# EAGLE design midiprog (EAGLE 6.5.0)
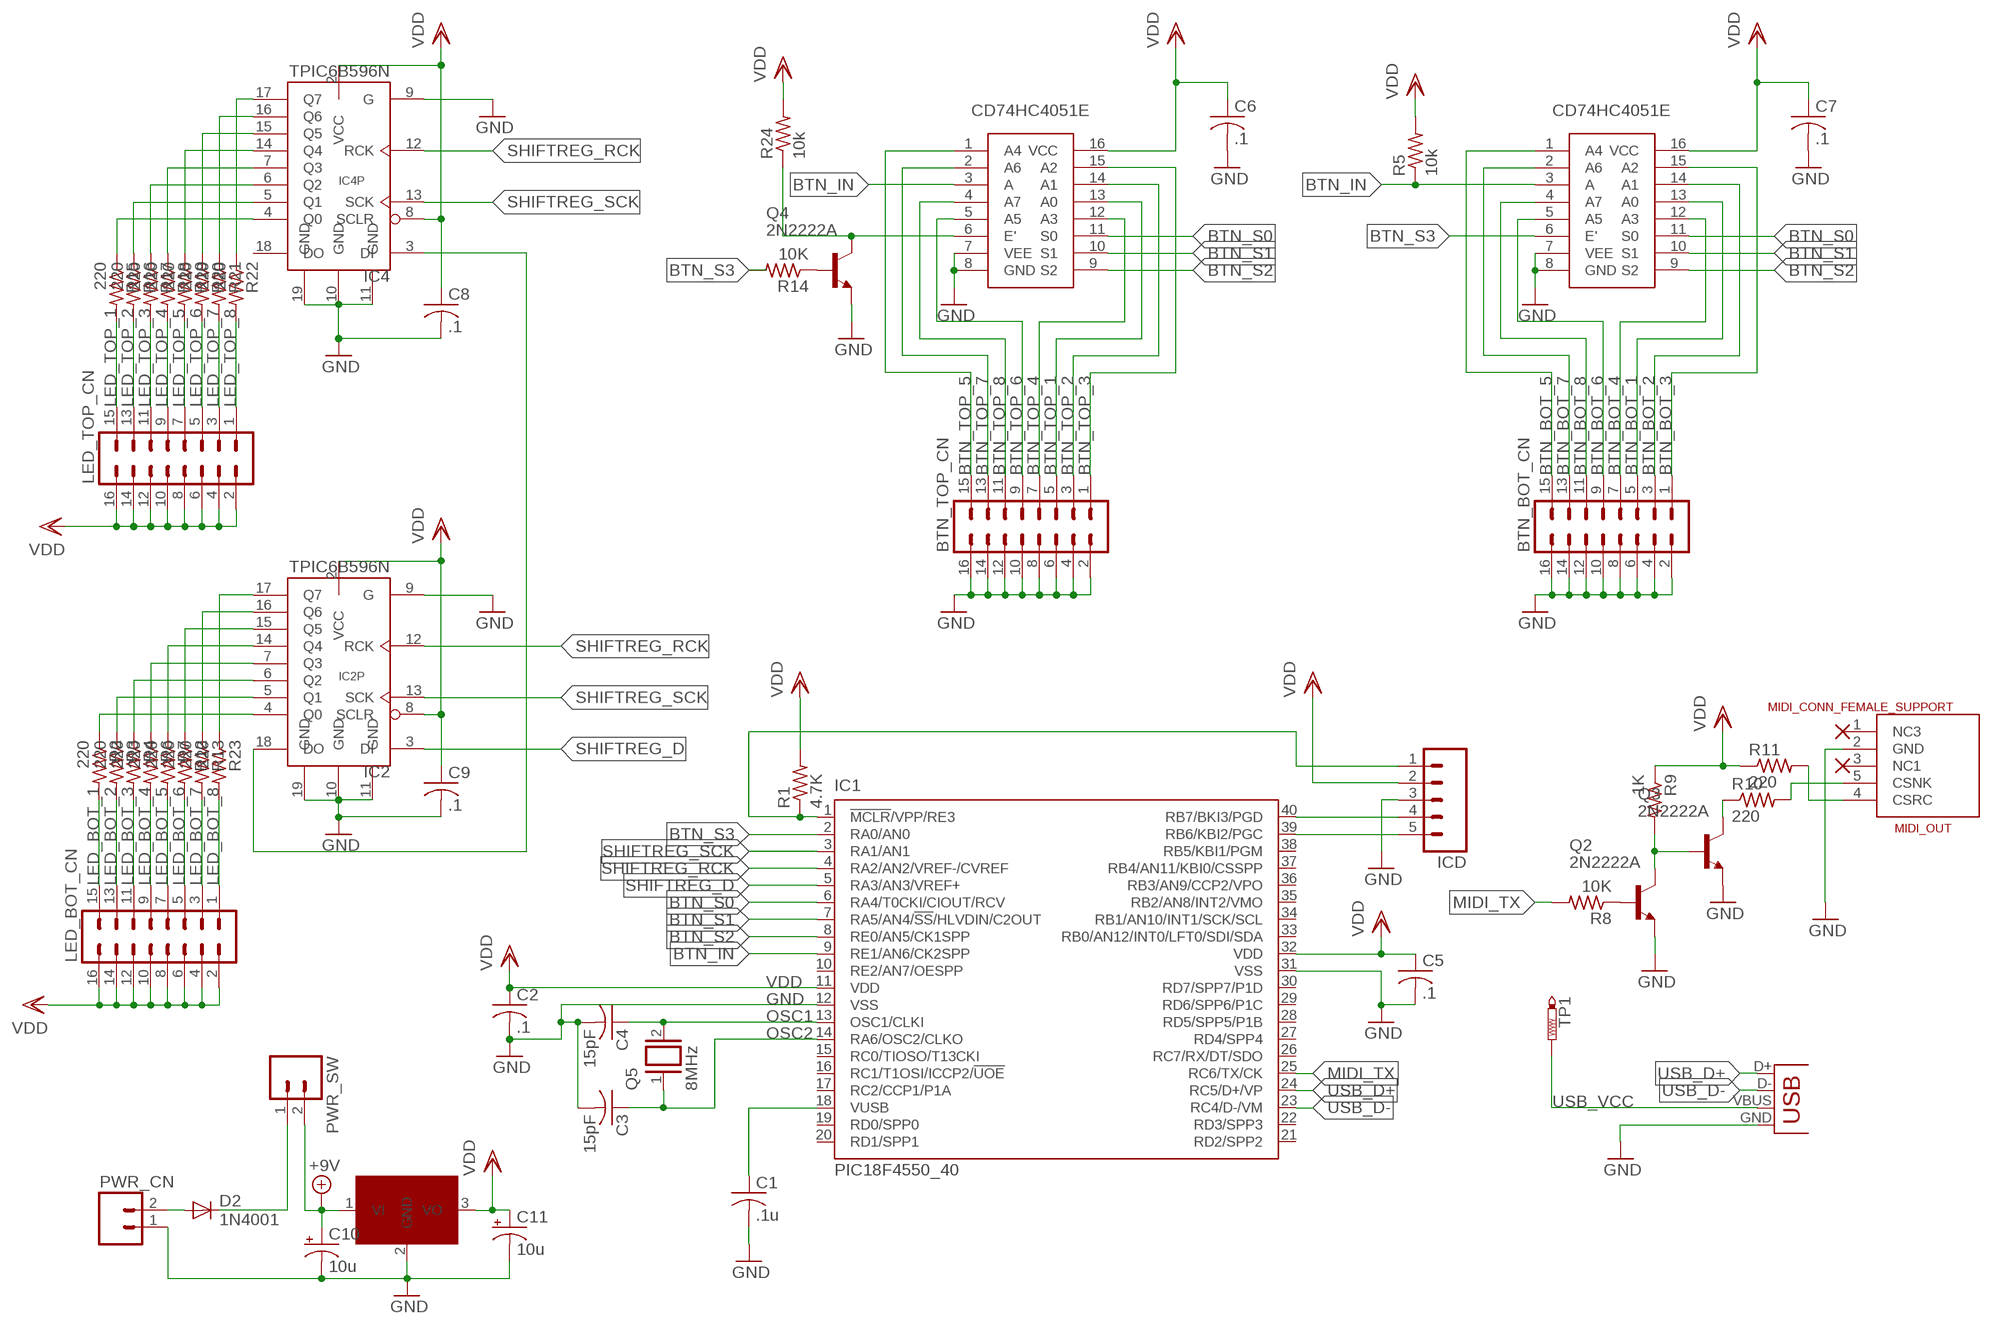
[diagram p0: schematic, sheet 1]

## Parts
BTN_BOT_CN  MA08-2  [MA08-2]
BTN_TOP_CN  MA08-2  [MA08-2]
C1  .1u  C-US050-025X075  [C050-025X075]
C2  .1  C-US050-025X075  [C050-025X075]
C3  15pF  C-US050-025X075  [C050-025X075]
C4  15pF  C-US050-025X075  [C050-025X075]
C5  .1  C-US050-025X075  [C050-025X075]
C6  .1  C-US050-025X075  [C050-025X075]
C7  .1  C-US050-025X075  [C050-025X075]
C8  .1  C-US050-025X075  [C050-025X075]
C9  .1  C-US050-025X075  [C050-025X075]
C10  10u  CPOL-USE2.5-6  [E2,5-6]
C11  10u  CPOL-USE2.5-6  [E2,5-6]
D2  1N4001  1N4004  [DO41-10]
IC1  PIC18F4550_40  [DIL40]
IC2  TPIC6B596N  [DIL20]
IC4  TPIC6B596N  [DIL20]
ICD  MA05  [05PA]
JP1  USB-B  USBPTH  [USB-B-PTH]
LED_BOT_CN  MA08-2  [MA08-2]
LED_TOP_CN  MA08-2  [MA08-2]
MIDI_OUT  MIDI_CONN_FEMALE_SUPPORT  [DIN_5_FEMALE_SUPPORT]
PWR_CN  M02  [02P]
PWR_SW  M02  [02P]
Q2  2N2222A  [TO18]
Q3  2N2222A  [TO18]
Q4  2N2222A  [TO18]
Q5  8MHz  XTAL/S  [QS]
R1  4.7K  R-US_0207/10  [0207/10]
R2  220  R-US_0207/10  [0207/10]
R3  220  R-US_0207/10  [0207/10]
R4  220  R-US_0207/10  [0207/10]
R5  10k  R-US_0207/10  [0207/10]
R6  220  R-US_0207/10  [0207/10]
R7  220  R-US_0207/10  [0207/10]
R8  10K  R-US_0207/10  [0207/10]
R9  1K  R-US_0207/10  [0207/10]
R10  220  R-US_0207/10  [0207/10]
R11  220  R-US_0207/10  [0207/10]
R12  220  R-US_0207/10  [0207/10]
R13  220  R-US_0207/10  [0207/10]
R14  10K  R-US_0207/10  [0207/10]
R15  220  R-US_0207/10  [0207/10]
R16  220  R-US_0207/10  [0207/10]
R17  220  R-US_0207/10  [0207/10]
R18  220  R-US_0207/10  [0207/10]
R19  220  R-US_0207/10  [0207/10]
R20  220  R-US_0207/10  [0207/10]
R21  220  R-US_0207/10  [0207/10]
R22  220  R-US_0207/10  [0207/10]
R23  220  R-US_0207/10  [0207/10]
R24  10k  R-US_0207/10  [0207/10]
TP1  PTR1PAD1-17  [P1-17]
U$1  CD74HC4051E  [CD74HC4051E]
U$2  CD74HC4051E  [CD74HC4051E]
U$3  7805  [JKDFJD]

## Nets
+9V: C10.+ PWR_SW.2 U$3.1(VI)
BTN_BOT_1: BTN_BOT_CN.5 U$1.13(A0)
BTN_BOT_2: BTN_BOT_CN.3 U$1.14(A1)
BTN_BOT_3: BTN_BOT_CN.1 U$1.15(A2)
BTN_BOT_4: BTN_BOT_CN.7 U$1.12(A3)
BTN_BOT_5: BTN_BOT_CN.15 U$1.1(A4)
BTN_BOT_6: BTN_BOT_CN.9 U$1.5(A5)
BTN_BOT_7: BTN_BOT_CN.13 U$1.2(A6)
BTN_BOT_8: BTN_BOT_CN.11 U$1.4(A7)
BTN_IN: IC1.9(RE1/AN6/CK2SPP) R5.1 U$1.3(A) U$2.3(A)
BTN_S0: IC1.6(RA4/T0CKI/CIOUT/RCV) U$1.11(S0) U$2.11(S0)
BTN_S1: IC1.7(RA5/AN4/!SS!/HLVDIN/C2OUT) U$1.10(S1) U$2.10(S1)
BTN_S2: IC1.8(RE0/AN5/CK1SPP) U$1.9(S2) U$2.9(S2)
BTN_S3: IC1.2(RA0/AN0) R14.2 U$1.6(E')
BTN_TOP_1: BTN_TOP_CN.5 U$2.13(A0)
BTN_TOP_2: BTN_TOP_CN.3 U$2.14(A1)
BTN_TOP_3: BTN_TOP_CN.1 U$2.15(A2)
BTN_TOP_4: BTN_TOP_CN.7 U$2.12(A3)
BTN_TOP_5: BTN_TOP_CN.15 U$2.1(A4)
BTN_TOP_6: BTN_TOP_CN.9 U$2.5(A5)
BTN_TOP_7: BTN_TOP_CN.13 U$2.2(A6)
BTN_TOP_8: BTN_TOP_CN.11 U$2.4(A7)
GND: BTN_BOT_CN.2 BTN_BOT_CN.4 BTN_BOT_CN.6 BTN_BOT_CN.8 BTN_BOT_CN.10 BTN_BOT_CN.12 BTN_BOT_CN.14 BTN_BOT_CN.16 BTN_TOP_CN.2 BTN_TOP_CN.4 BTN_TOP_CN.6 BTN_TOP_CN.8 BTN_TOP_CN.10 BTN_TOP_CN.12 BTN_TOP_CN.14 BTN_TOP_CN.16 C1.2 C2.2 C3.2 C4.2 C5.2 C6.2 C7.2 C8.2 C9.2 C10.- C11.- IC1.12(VSS) IC1.31(VSS) IC2.9(G) IC2.10(GND) IC2.11(GND) IC2.19(GND) IC4.9(G) IC4.10(GND) IC4.11(GND) IC4.19(GND) ICD.3 JP1.GND MIDI_OUT.2(GND) PWR_CN.1 Q2.1(E) Q3.1(E) Q4.1(E) U$1.7(VEE) U$1.8(GND) U$2.7(VEE) U$2.8(GND) U$3.2(GND)
LED_BOT_1: LED_BOT_CN.15 R2.2
LED_BOT_2: LED_BOT_CN.13 R3.2
LED_BOT_3: LED_BOT_CN.11 R4.2
LED_BOT_4: LED_BOT_CN.9 R6.2
LED_BOT_5: LED_BOT_CN.7 R7.2
LED_BOT_6: LED_BOT_CN.5 R12.2
LED_BOT_7: LED_BOT_CN.3 R13.2
LED_BOT_8: LED_BOT_CN.1 R23.2
LED_TOP_1: LED_TOP_CN.15 R15.2
LED_TOP_2: LED_TOP_CN.13 R16.2
LED_TOP_3: LED_TOP_CN.11 R17.2
LED_TOP_4: LED_TOP_CN.9 R18.2
LED_TOP_5: LED_TOP_CN.7 R19.2
LED_TOP_6: LED_TOP_CN.5 R20.2
LED_TOP_7: LED_TOP_CN.3 R21.2
LED_TOP_8: LED_TOP_CN.1 R22.2
MIDI_TX: IC1.25(RC6/TX/CK) R8.2
N$1: IC1.1(!MCLR!/VPP/RE3) ICD.1 R1.1
N$4: Q2.2(B) R8.1
N$5: Q2.3(C) Q3.2(B) R9.2
N$7: Q3.3(C) R10.1
N$8: MIDI_OUT.4(CSRC) R11.2
N$9: MIDI_OUT.5(CSNK) R10.2
N$16: IC1.39(RB6/KBI2/PGC) ICD.5
N$17: IC1.40(RB7/BKI3/PGD) ICD.4
N$18: C1.1 IC1.18(VUSB)
N$19: IC4.4(Q0) R15.1
N$20: IC4.5(Q1) R16.1
N$21: IC4.6(Q2) R17.1
N$22: IC4.7(Q3) R18.1
N$23: IC4.14(Q4) R19.1
N$25: IC4.15(Q5) R20.1
N$26: IC4.16(Q6) R21.1
N$29: IC4.17(Q7) R22.1
N$31: IC2.18(DO) IC4.3(DI)
N$34: D2.A PWR_CN.2
N$35: D2.C PWR_SW.1
N$38: IC2.4(Q0) R2.1
N$39: IC2.5(Q1) R3.1
N$40: IC2.6(Q2) R4.1
N$41: IC2.7(Q3) R6.1
N$42: IC2.14(Q4) R7.1
N$43: IC2.15(Q5) R12.1
N$44: IC2.16(Q6) R13.1
N$45: IC2.17(Q7) R23.1
N$53: Q4.2(B) R14.1
N$54: Q4.3(C) R24.1 U$2.6(E')
OSC1: C4.1 IC1.13(OSC1/CLKI) Q5.2
OSC2: C3.1 IC1.14(RA6/OSC2/CLKO) Q5.1
SHIFTREG_D: IC1.5(RA3/AN3/VREF+) IC2.3(DI)
SHIFTREG_RCK: IC1.4(RA2/AN2/VREF-/CVREF) IC2.12(RCK) IC4.12(RCK)
SHIFTREG_SCK: IC1.3(RA1/AN1) IC2.13(SCK) IC4.13(SCK)
USB_D+: IC1.24(RC5/D+/VP) JP1.D+
USB_D-: IC1.23(RC4/D-/VM) JP1.D-
USB_VCC: JP1.VBUS TP1.TP
VDD: C2.1 C5.1 C6.1 C7.1 C8.1 C9.1 C11.+ IC1.11(VDD) IC1.32(VDD) IC2.2(VCC) IC2.8(SCLR) IC4.2(VCC) IC4.8(SCLR) ICD.2 LED_BOT_CN.2 LED_BOT_CN.4 LED_BOT_CN.6 LED_BOT_CN.8 LED_BOT_CN.10 LED_BOT_CN.12 LED_BOT_CN.14 LED_BOT_CN.16 LED_TOP_CN.2 LED_TOP_CN.4 LED_TOP_CN.6 LED_TOP_CN.8 LED_TOP_CN.10 LED_TOP_CN.12 LED_TOP_CN.14 LED_TOP_CN.16 R1.2 R5.2 R9.1 R11.1 R24.2 U$1.16(VCC) U$2.16(VCC) U$3.3(VO)
Unconnected: IC1.10(RE2/AN7/OESPP) IC1.15(RC0/TIOSO/T13CKI) IC1.16(RC1/T1OSI/ICCP2/!UOE) IC1.17(RC2/CCP1/P1A) IC1.19(RD0/SPP0) IC1.20(RD1/SPP1) IC1.21(RD2/SPP2) IC1.22(RD3/SPP3) IC1.26(RC7/RX/DT/SDO) IC1.27(RD4/SPP4) IC1.28(RD5/SPP5/P1B) IC1.29(RD6/SPP6/P1C) IC1.30(RD7/SPP7/P1D) IC1.33(RB0/AN12/INT0/LFT0/SDI/SDA) IC1.34(RB1/AN10/INT1/SCK/SCL) IC1.35(RB2/AN8/INT2/VMO) IC1.36(RB3/AN9/CCP2/VPO) IC1.37(RB4/AN11/KBI0/CSSPP) IC1.38(RB5/KBI1/PGM) IC4.18(DO) MIDI_OUT.1(NC3) MIDI_OUT.3(NC1)

## Library data of the parts
BTN_BOT_CN BTN_TOP_CN LED_BOT_CN LED_TOP_CN = con-lstb:MA08-2: PIN HEADER; OC_FARNELL: unknown; OC_NEWARK: unknown
C1-C9 = rcl:C-US: CAPACITOR, American symbol
C10 C11 = rcl:CPOL-US: POLARIZED CAPACITOR, American symbol
D2 = diode:1N4004: DIODE general purpose rectifier, 1 A
IC1 = microchip:PIC18F4*_40: USB Microcontrollers with nanoWatt Technology High-Performance, Enhanced Flash, 28/40/44-Pin, Source: http://ww1.microchip.com/downloads/en/devicedoc/39632c.pdf; MF: MICROCHIP; MPN: PIC18F4550-I/P; OC_FARNELL: 9321357; OC_NEWARK: 74K8623
IC2 IC4 = tpic:TPIC6B596
ICD = con-amp-quick:MA05: AMP QUICK CONNECTOR; OC_FARNELL: unknown; OC_NEWARK: unknown
JP1 = SparkFun-Connectors:USB: USB Connectors USB-B-PTH is fully proven SKU : PRT-00139/CONN-08278 USB-miniB is fully proven SKU : PRT-00587 USB-A-PCB is untested. USB-A-H is throughly reviewed, but untested. Spark Fun Electronics SKU : PRT-00437 USB-B-SMT is throughly reviewed, but untested. Needs silkscreen touching up. USB-A-S has not been used/tested USB-MB-H has not been used/tested USB-MICROB has been used. CONN-09505; PROD_ID: CONN-08278
MIDI_OUT = SparkFun-Connectors:MIDI_CONN_FEMALE_SUPPORT: MIDI connector with strain relief (DIN-5 female)
PWR_CN PWR_SW = con-amp-quick:M02: AMP QUICK CONNECTOR; OC_FARNELL: unknown; OC_NEWARK: unknown
Q2-Q4 = transistor-npn:2N2222*: NPN Transistor
Q5 = special:XTAL/S: CRYSTAL
R1-R24 = rcl:R-US_: RESISTOR, American symbol
TP1 = testpad:PTR1: TEST PIN
U$1 U$2 = joe:CD74HC4051E
U$3 = 7805:7805

## Board
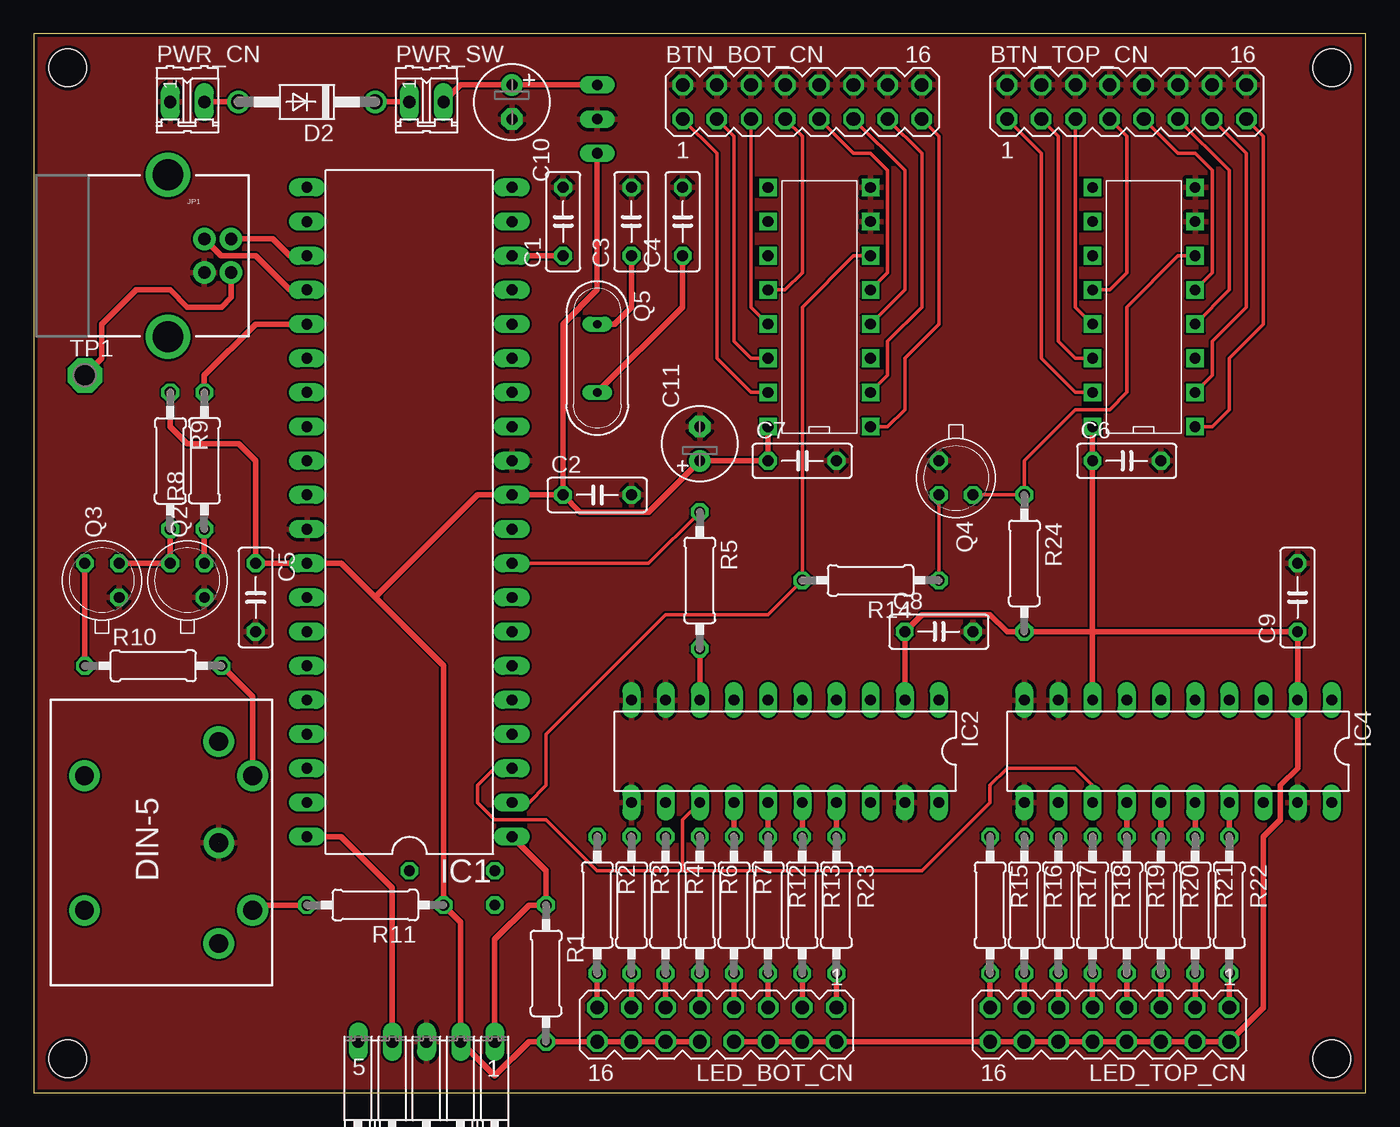
[diagram p1: board, top side]
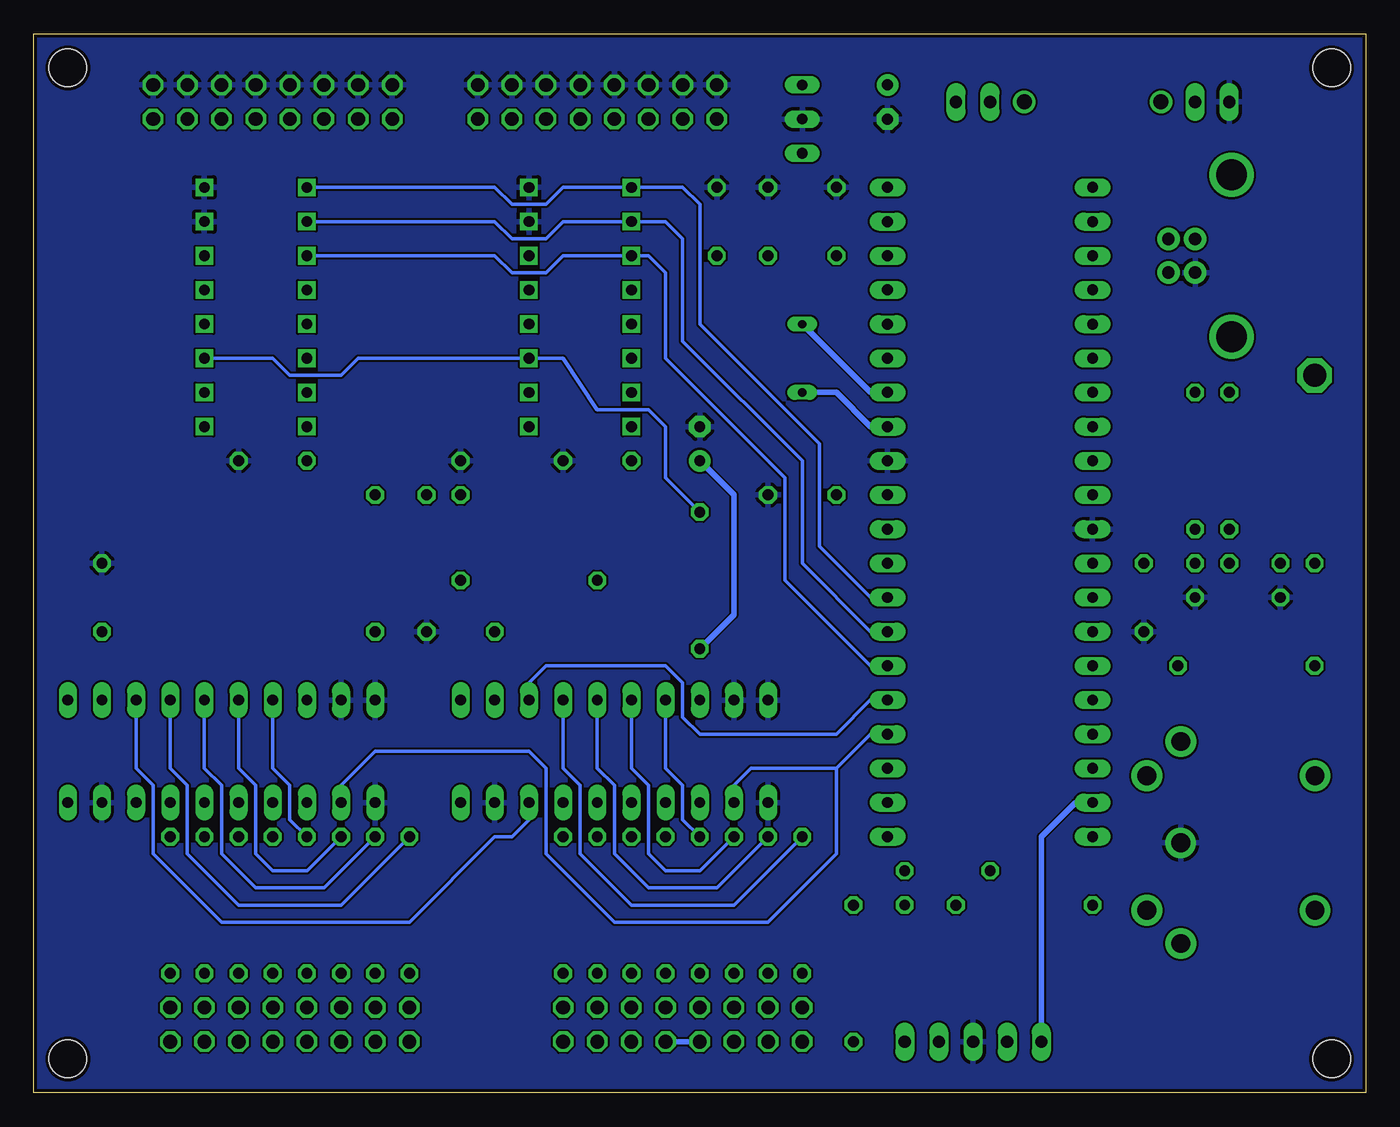
[diagram p2: board, bottom side, seen from below]

Size 99.06 x 78.74 mm. Coordinates in mm from the lower left corner, seen from the top.
Outline: 99.06,78.74 0,78.74 0,0 99.06,0 99.06,78.74
Copper layers (1*16): Top 0.035mm / dielectric 1.5mm / Bottom 0.035mm
Design rules "SeeedStudio_DRU-2layer_no_angle_20130527": minimum track width 6mil, minimum drill 12mil, track to track 6mil, track to pad 6mil, pad to pad 6mil, via to via 6mil, smd to smd 0mil, copper to edge 10mil, drill to drill 10mil, minimum pad ring 10mil, minimum via ring 6mil, stop-mask expansion 2mil, vias tented up to drill 25mil, thermal gap 10mil
Holes 2.8 mm at 96.52,2.54 96.52,76.2 2.54,76.2 2.54,2.54

### Footprints (pad centres in the part's own frame; a part is rotated, then mirrored left to right if it is on the bottom)
MA08-2 = drill 1.016 octagon: 1 -8.89,-1.27; 2 -8.89,1.27; 3 -6.35,-1.27; 4 -6.35,1.27; 5 -3.81,-1.27; 6 -3.81,1.27; 7 -1.27,-1.27; 8 -1.27,1.27; 9 1.27,-1.27; 10 1.27,1.27; 11 3.81,-1.27; 12 3.81,1.27; 13 6.35,-1.27; 14 6.35,1.27; 15 8.89,-1.27; 16 8.89,1.27
C050-025X075 = drill 0.813 octagon: 1 -2.54,0; 2 2.54,0
E2,5-6 = drill 0.813 pad 1.6: + -1.27,0 | drill 0.813 pad 1.6 octagon: - 1.27,0
DO41-10 = drill 1.118: A 5.08,0; C -5.08,0
DIL40 = drill 0.813 long: 1 -24.13,-7.62; 2 -21.59,-7.62; 3 -19.05,-7.62; 4 -16.51,-7.62; 5 -13.97,-7.62; 6 -11.43,-7.62; 7 -8.89,-7.62; 8 -6.35,-7.62; 9 -3.81,-7.62; 10 -1.27,-7.62; 11 1.27,-7.62; 12 3.81,-7.62; 13 6.35,-7.62; 14 8.89,-7.62; 15 11.43,-7.62; 16 13.97,-7.62; 17 16.51,-7.62; 18 19.05,-7.62; 19 21.59,-7.62; 20 24.13,-7.62; 21 24.13,7.62; 22 21.59,7.62; 23 19.05,7.62; 24 16.51,7.62; 25 13.97,7.62; 26 11.43,7.62; 27 8.89,7.62; 28 6.35,7.62; 29 3.81,7.62; 30 1.27,7.62; 31 -1.27,7.62; 32 -3.81,7.62; 33 -6.35,7.62; 34 -8.89,7.62; 35 -11.43,7.62; 36 -13.97,7.62; 37 -16.51,7.62; 38 -19.05,7.62; 39 -21.59,7.62; 40 -24.13,7.62
DIL20 = drill 0.813 long: 1 -11.43,-3.81; 2 -8.89,-3.81; 3 -6.35,-3.81; 4 -3.81,-3.81; 5 -1.27,-3.81; 6 1.27,-3.81; 7 3.81,-3.81; 8 6.35,-3.81; 9 8.89,-3.81; 10 11.43,-3.81; 11 11.43,3.81; 12 8.89,3.81; 13 6.35,3.81; 14 3.81,3.81; 15 1.27,3.81; 16 -1.27,3.81; 17 -3.81,3.81; 18 -6.35,3.81; 19 -8.89,3.81; 20 -11.43,3.81
05PA = drill 0.914 long: 1 -5.08,0; 2 -2.54,0; 3 0,0; 4 2.54,0; 5 5.08,0
USB-B-PTH = drill 0.914 pad 1.676: D+ 0,1.25; D- 1.981,1.25; GND 0,-1.25; VBUS 1.981,-1.25 | drill 2.286: S1 -2.718,-6.02; S2 -2.718,6.02
DIN_5_FEMALE_SUPPORT = drill 1.4 pad 2.286: 1 7.94,3.6; 2 0.46,3.61; 3 -7.07,3.6; 4 5.47,6.13; 5 -4.53,6.12; 6 -4.53,-6.382; 7 5.478,-6.382
02P = drill 0.914 long: 1 -1.27,0; 2 1.27,0
TO18 = drill 0.813 octagon: 1 -1.27,-1.27; 2 1.27,-1.27; 3 1.27,1.27
QS = drill 0.61 long: 1 -2.54,0; 2 2.54,0
0207/10 = drill 0.813 octagon: 1 -5.08,0; 2 5.08,0
P1-17 = drill 1.702 pad 2.54 octagon: TP 0,0
CD74HC4051E = drill 0.8 square: 1 -10.16,-7.62; 2 -7.62,-7.62; 3 -5.08,-7.62; 4 -2.54,-7.62; 5 0,-7.62; 6 2.54,-7.62; 7 5.08,-7.62; 8 7.62,-7.62; 9 7.62,0; 10 5.08,0; 11 2.54,0; 12 0,0; 13 -2.54,0; 14 -5.08,0; 15 -7.62,0; 16 -10.16,0
JKDFJD = drill 0.8 long: 1 -2.54,0; 2 0,0; 3 2.54,0

### Placement (x,y rotation side)
BTN_BOT_CN  57.15,73.66 0 top
BTN_TOP_CN  81.28,73.66 0 top
C1  39.37,64.77 90 top
C2  41.91,44.45 0 top
C3  44.45,64.77 90 top
C4  48.26,64.77 90 top
C5  16.51,36.83 270 top
C6  81.28,46.99 0 top
C7  57.15,46.99 0 top
C8  67.31,34.29 0 top
C9  93.98,36.83 90 top
C10  35.56,73.66 270 top
C11  49.53,48.26 90 top
D2  20.32,73.66 180 top
IC1  27.94,43.18 90 top
IC2  55.88,25.4 180 top
IC4  85.09,25.4 180 top
ICD  29.21,3.81 180 top
JP1  12.7,62.23 0 top
LED_BOT_CN  50.8,5.08 180 top
LED_TOP_CN  80.01,5.08 180 top
MIDI_OUT  10.16,19.05 270 top
PWR_CN  11.43,73.66 0 top
PWR_SW  29.21,73.66 0 top
Q2  11.43,38.1 90 top
Q3  5.08,38.1 90 top
Q4  68.58,45.72 270 top
Q5  41.91,54.61 270 top
R1  38.1,8.89 270 top
R2  41.91,13.97 270 top
R3  44.45,13.97 270 top
R4  46.99,13.97 270 top
R5  49.53,38.1 270 top
R6  49.53,13.97 270 top
R7  52.07,13.97 270 top
R8  12.7,46.99 90 top
R9  10.16,46.99 270 top
R10  8.89,31.75 0 top
R11  25.4,13.97 180 top
R12  54.61,13.97 270 top
R13  57.15,13.97 270 top
R14  62.23,38.1 180 top
R15  71.12,13.97 270 top
R16  73.66,13.97 270 top
R17  76.2,13.97 270 top
R18  78.74,13.97 270 top
R19  81.28,13.97 270 top
R20  83.82,13.97 270 top
R21  86.36,13.97 270 top
R22  88.9,13.97 270 top
R23  59.69,13.97 270 top
R24  73.66,39.37 270 top
TP1  3.81,53.34 0 top
U$1  54.61,59.69 90 top
U$2  78.74,59.69 90 top
U$3  41.91,72.39 270 top

### Tracks (layer width: path | path; a pad name or v marks a point on that pad's centre or on a via)
+9V
  Top 0.406: U$3.1 C10.+ 31.75,74.93 PWR_SW.2
BTN_BOT_1
  Top 0.254: U$1.13 53.34,58.42 BTN_BOT_CN.5
BTN_BOT_2
  Top 0.254: U$1.14 53.34,54.61 52.07,55.88 52.07,71.12 BTN_BOT_CN.3
BTN_BOT_3
  Top 0.254: U$1.15 53.34,52.07 50.8,54.61 50.8,69.85 BTN_BOT_CN.1
BTN_BOT_4
  Top 0.254: U$1.12 55.88,59.69 57.15,60.96 57.15,71.12 BTN_BOT_CN.7
BTN_BOT_5
  Top 0.254: U$1.1 63.5,49.53 64.77,50.8 64.77,54.61 67.31,57.15 67.31,71.12 BTN_BOT_CN.15
BTN_BOT_6
  Top 0.254: U$1.5 63.5,60.96 63.5,68.58 62.23,69.85 60.96,69.85 BTN_BOT_CN.9
BTN_BOT_7
  Top 0.254: U$1.2 63.5,53.34 63.5,55.88 66.04,58.42 66.04,69.85 BTN_BOT_CN.13
BTN_BOT_8
  Top 0.254: U$1.4 64.77,59.69 64.77,68.58 BTN_BOT_CN.11
BTN_IN
  Top 0.254: IC1.9 45.72,39.37 R5.1
  Bottom 0.254: R5.1 52.07,45.72 52.07,49.53 53.34,50.8 57.15,50.8 59.69,54.61 U$1.3 74.93,54.61 76.2,53.34 80.01,53.34 81.28,54.61 U$2.3
BTN_S0
  Bottom 0.254: IC1.6 36.83,31.75 43.18,38.1 43.18,45.72 52.07,54.61 52.07,60.96 53.34,62.23 U$1.11 59.69,62.23 60.96,60.96 63.5,60.96 64.77,62.23 U$2.11
BTN_S1
  Bottom 0.254: IC1.7 36.83,34.29 41.91,39.37 41.91,46.99 50.8,55.88 50.8,63.5 52.07,64.77 U$1.10 59.69,64.77 60.96,63.5 63.5,63.5 64.77,64.77 U$2.10
BTN_S2
  Bottom 0.254: IC1.8 36.83,36.83 40.64,40.64 40.64,48.26 49.53,57.15 49.53,66.04 50.8,67.31 U$1.9 59.69,67.31 60.96,66.04 63.5,66.04 64.77,67.31 U$2.9
BTN_S3
  Top 0.254: IC1.2 36.83,21.59 38.1,22.86 38.1,26.67 46.99,35.56 54.61,35.56 R14.2 57.15,58.42 60.96,62.23 U$1.6
BTN_TOP_1
  Top 0.254: U$2.13 77.47,58.42 BTN_TOP_CN.5
BTN_TOP_2
  Top 0.254: U$2.14 77.47,54.61 76.2,55.88 76.2,71.12 BTN_TOP_CN.3
BTN_TOP_3
  Top 0.254: U$2.15 77.47,52.07 74.93,54.61 74.93,69.85 BTN_TOP_CN.1
BTN_TOP_4
  Top 0.254: U$2.12 80.01,59.69 81.28,60.96 81.28,71.12 BTN_TOP_CN.7
BTN_TOP_5
  Top 0.254: U$2.1 87.63,49.53 88.9,50.8 88.9,54.61 91.44,57.15 91.44,71.12 BTN_TOP_CN.15
BTN_TOP_6
  Top 0.254: U$2.5 87.63,60.96 87.63,68.58 86.36,69.85 85.09,69.85 BTN_TOP_CN.9
BTN_TOP_7
  Top 0.254: U$2.2 87.63,53.34 87.63,55.88 90.17,58.42 90.17,69.85 BTN_TOP_CN.13
BTN_TOP_8
  Top 0.254: U$2.4 88.9,59.69 88.9,68.58 BTN_TOP_CN.11
GND
  pour Bottom: 100.33,-1.27 -1.27,-1.27 -1.27,80.01 100.33,80.01
  pour Top: 101.6,-2.54 -2.54,-2.54 -2.54,81.28 101.6,81.28
LED_BOT_1
  Top 0.406: LED_BOT_CN.15 R2.2
LED_BOT_2
  Top 0.406: LED_BOT_CN.13 R3.2
LED_BOT_3
  Top 0.406: LED_BOT_CN.11 R4.2
LED_BOT_4
  Top 0.406: LED_BOT_CN.9 R6.2
LED_BOT_5
  Top 0.406: LED_BOT_CN.7 R7.2
LED_BOT_6
  Top 0.406: LED_BOT_CN.5 R12.2
LED_BOT_7
  Top 0.406: LED_BOT_CN.3 R13.2
LED_BOT_8
  Top 0.406: LED_BOT_CN.1 R23.2
LED_TOP_1
  Top 0.406: LED_TOP_CN.15 R15.2
LED_TOP_2
  Top 0.406: LED_TOP_CN.13 R16.2
LED_TOP_3
  Top 0.406: LED_TOP_CN.11 R17.2
LED_TOP_4
  Top 0.406: LED_TOP_CN.9 R18.2
LED_TOP_5
  Top 0.406: LED_TOP_CN.7 R19.2
LED_TOP_6
  Top 0.406: LED_TOP_CN.5 R20.2
LED_TOP_7
  Top 0.406: LED_TOP_CN.3 R21.2
LED_TOP_8
  Top 0.406: LED_TOP_CN.1 R22.2
MIDI_TX
  Top 0.406: IC1.25 16.51,57.15 12.7,53.34 R8.2
N$1
  Top 0.406: ICD.1 34.29,11.43 36.83,13.97 R1.1 38.1,16.51 IC1.1
N$4
  Top 0.406: R8.1 Q2.2
N$5
  Top 0.406: R9.2 Q2.3 Q3.2
N$7
  Top 0.406: Q3.3 R10.1
N$8
  Top 0.406: R11.2 16.68,13.97 MIDI_OUT.4
N$9
  Top 0.406: MIDI_OUT.5 16.28,29.44 R10.2
N$16
  Bottom 0.406: ICD.5 24.13,19.05 21.59,21.59 IC1.39
N$17
  Top 0.406: ICD.4 26.67,15.24 22.86,19.05 IC1.40
N$18
  Top 0.406: IC1.18 C1.1
N$19
  Bottom 0.254: IC4.4 88.9,24.13 87.63,22.86 87.63,17.78 83.82,13.97 76.2,13.97 R15.1
N$20
  Bottom 0.254: IC4.5 86.36,24.13 85.09,22.86 85.09,17.78 82.55,15.24 77.47,15.24 R16.1
N$21
  Bottom 0.254: IC4.6 83.82,24.13 82.55,22.86 82.55,17.78 81.28,16.51 78.74,16.51 R17.1
N$22
  Bottom 0.254: IC4.7 81.28,24.13 80.01,22.86 80.01,20.32 R18.1
N$23
  Top 0.406: R19.1 IC4.14
N$25
  Top 0.406: R20.1 IC4.15
N$26
  Top 0.406: R21.1 IC4.16
N$29
  Top 0.406: R22.1 IC4.17
N$31
  Bottom 0.254: IC4.3 91.44,24.13 90.17,22.86 90.17,17.78 85.09,12.7 71.12,12.7 64.77,19.05 63.5,19.05 62.23,20.32 IC2.18
N$34
  Top 0.406: D2.A PWR_CN.2
N$35
  Top 0.406: PWR_SW.1 D2.C
N$38
  Bottom 0.254: IC2.4 59.69,24.13 58.42,22.86 58.42,17.78 54.61,13.97 46.99,13.97 R2.1
N$39
  Bottom 0.254: IC2.5 57.15,24.13 55.88,22.86 55.88,17.78 53.34,15.24 48.26,15.24 R3.1
N$40
  Bottom 0.254: IC2.6 54.61,24.13 53.34,22.86 53.34,17.78 52.07,16.51 49.53,16.51 R4.1
N$41
  Bottom 0.254: IC2.7 52.07,24.13 50.8,22.86 50.8,20.32 R6.1
N$42
  Top 0.406: R7.1 IC2.14
N$43
  Top 0.406: R12.1 IC2.15
N$44
  Top 0.406: R13.1 IC2.16
N$45
  Top 0.406: R23.1 IC2.17
N$53
  Top 0.254: R14.1 Q4.2
N$54
  Top 0.254: Q4.3 R24.1 73.66,46.99 77.47,50.8 80.01,50.8 81.28,52.07 81.28,58.42 85.09,62.23 U$2.6
N$162  (via drill 0.8 pad 1.27)
  other vias: 34.29,13.97
N$163  (via drill 0.8 pad 1.27)
  other vias: 34.29,16.51
N$164  (via drill 0.8 pad 1.27)
  other vias: 27.94,16.51
OSC1
  Top 0.406: C4.1 48.26,58.42 Q5.2
  Bottom 0.406: Q5.2 39.37,52.07 36.83,49.53 IC1.13
OSC2
  Top 0.406: Q5.1 43.18,57.15 44.45,58.42 C3.1
  Bottom 0.406: Q5.1 36.83,52.07 IC1.14
SHIFTREG_D
  Bottom 0.254: IC2.3 62.23,30.48 60.96,31.75 52.07,31.75 50.8,30.48 50.8,27.94 49.53,26.67 39.37,26.67 36.83,29.21 IC1.5
SHIFTREG_RCK
  Bottom 0.254: IC4.12 76.2,22.86 73.66,25.4 62.23,25.4 60.96,24.13 60.96,17.78 55.88,12.7 44.45,12.7 39.37,17.78 39.37,24.13 | 39.37,24.13 36.83,26.67 IC1.4 | IC2.12 46.99,22.86 45.72,24.13 39.37,24.13
SHIFTREG_SCK
  Top 0.254: IC4.13 78.74,22.86 77.47,24.13 72.39,24.13 71.12,22.86 71.12,21.59 66.04,16.51 48.26,16.51 | 48.26,16.51 41.91,16.51 38.1,20.32 34.29,20.32 33.02,21.59 33.02,22.86 34.29,24.13 IC1.3 | IC2.13 48.26,20.32 48.26,16.51
USB_D+
  Top 0.406: IC1.24 19.05,59.69 16.51,62.23 13.95,62.23 JP1.D+
USB_D-
  Top 0.406: IC1.23 19.05,62.23 17.78,63.5 14.7,63.5 JP1.D-
USB_VCC
  Top 0.406: JP1.VBUS 14.68,59.13 13.97,58.42 11.43,58.42 10.16,59.69 7.62,59.69 5.08,57.15 5.08,54.61 TP1.TP
VDD
  Top 0.406: IC2.2 C8.1 66.04,35.56 71.12,35.56 72.39,34.29 R24.2 78.74,34.29 | LED_BOT_CN.8 LED_BOT_CN.6 LED_BOT_CN.4 LED_BOT_CN.2 LED_TOP_CN.16 LED_TOP_CN.14 LED_TOP_CN.12 LED_TOP_CN.10 LED_TOP_CN.8 LED_TOP_CN.6 LED_TOP_CN.4 LED_TOP_CN.2 91.44,6.35 91.44,19.05 92.71,20.32 92.71,22.86 93.98,24.13 IC4.2 C9.1 78.74,34.29 | LED_BOT_CN.10 LED_BOT_CN.12 LED_BOT_CN.14 LED_BOT_CN.16 R1.2 36.83,3.81 34.29,1.27 ICD.2 31.75,12.7 R11.1 30.48,31.75 25.4,36.83 | R9.1 10.16,49.53 11.43,48.26 15.24,48.26 16.51,46.99 C5.1 IC1.32 22.86,39.37 25.4,36.83 | U$1.16 C7.1 C11.+ 45.72,43.18 40.64,43.18 C2.1 | C2.1 IC1.11 33.02,44.45 25.4,36.83 | C2.1 39.37,57.15 41.91,59.69 U$3.3 | U$2.16 C6.1 78.74,34.29 | IC2.8 R5.2 | IC4.8 78.74,34.29
  Bottom 0.406: LED_BOT_CN.8 LED_BOT_CN.10 | R5.2 46.99,35.56 46.99,44.45 C11.+